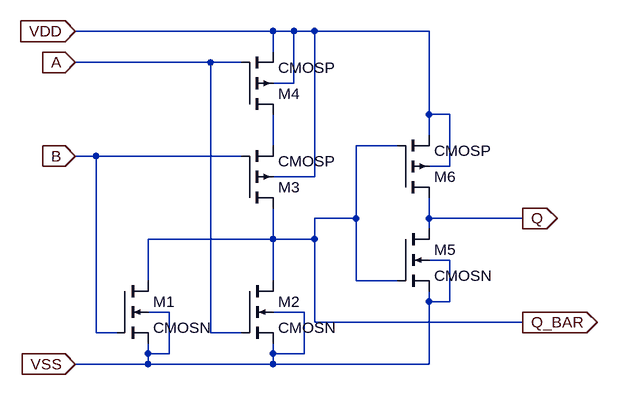
[diagram p0: schematic my_cmos_or.asc]
my_cmos_or.asc, the LTspice schematic file:
Version 4
SHEET 1 880 680
WIRE 112 -384 -192 -384
WIRE 144 -384 112 -384
WIRE 176 -384 144 -384
WIRE 352 -384 176 -384
WIRE 112 -352 112 -384
WIRE 16 -336 -192 -336
WIRE 64 -336 16 -336
WIRE 144 -304 144 -384
WIRE 144 -304 112 -304
WIRE 352 -256 352 -384
WIRE 384 -256 352 -256
WIRE 352 -224 352 -256
WIRE 112 -208 112 -256
WIRE 304 -208 240 -208
WIRE -160 -192 -192 -192
WIRE 64 -192 -160 -192
WIRE 384 -176 384 -256
WIRE 384 -176 352 -176
WIRE 176 -160 176 -384
WIRE 176 -160 112 -160
WIRE 240 -96 240 -208
WIRE 240 -96 176 -96
WIRE 352 -96 352 -128
WIRE 496 -96 352 -96
WIRE 352 -80 352 -96
WIRE 112 -64 112 -112
WIRE 112 -64 -80 -64
WIRE 176 -64 176 -96
WIRE 176 -64 112 -64
WIRE 384 -32 352 -32
WIRE -80 0 -80 -64
WIRE 112 0 112 -64
WIRE 240 0 240 -96
WIRE 304 0 240 0
WIRE 352 32 352 16
WIRE 384 32 384 -32
WIRE 384 32 352 32
WIRE -48 48 -80 48
WIRE 160 48 112 48
WIRE 176 64 176 -64
WIRE 496 64 176 64
WIRE -160 80 -160 -192
WIRE -128 80 -160 80
WIRE 16 80 16 -336
WIRE 64 80 16 80
WIRE -80 112 -80 96
WIRE -48 112 -48 48
WIRE -48 112 -80 112
WIRE 112 112 112 96
WIRE 160 112 160 48
WIRE 160 112 112 112
WIRE -80 128 -80 112
WIRE -80 128 -192 128
WIRE 112 128 112 112
WIRE 112 128 -80 128
WIRE 352 128 352 32
WIRE 352 128 112 128
FLAG 496 -96 Q
IOPIN 496 -96 Out
FLAG -192 -384 VDD
IOPIN -192 -384 In
FLAG -192 -336 A
IOPIN -192 -336 In
FLAG -192 -192 B
IOPIN -192 -192 In
FLAG -192 128 VSS
IOPIN -192 128 In
FLAG 496 64 Q_BAR
IOPIN 496 64 Out
SYMBOL nmos4 -128 0 R0
SYMATTR InstName M1
SYMATTR Value2 l=0.18u w=1.8u m=1
SYMATTR Value CMOSN
SYMBOL nmos4 64 0 R0
SYMATTR InstName M2
SYMATTR Value2 l=0.18u w=1.8u m=1
SYMATTR Value CMOSN
SYMBOL pmos4 64 -112 M180
SYMATTR InstName M3
SYMATTR Value2 l=0.18u w=1.8u m=1
SYMATTR Value CMOSP
SYMBOL pmos4 64 -256 M180
SYMATTR InstName M4
SYMATTR Value2 l=0.18u w=1.8u m=1
SYMATTR Value CMOSP
SYMBOL nmos4 304 -80 R0
SYMATTR InstName M5
SYMATTR Value2 l=0.18u w=1.8u m=1
SYMATTR Value CMOSN
SYMBOL pmos4 304 -128 M180
SYMATTR InstName M6
SYMATTR Value2 l=0.18u w=1.8u m=1
SYMATTR Value CMOSP

The netlist it stands for:
* my_cmos_or.asc
M1 Q_BAR B VSS VSS CMOSN l=0.18u w=1.8u m=1
M2 Q_BAR A VSS VSS CMOSN l=0.18u w=1.8u m=1
M3 Q_BAR B N001 VDD CMOSP l=0.18u w=1.8u m=1
M4 N001 A VDD VDD CMOSP l=0.18u w=1.8u m=1
M5 Q Q_BAR VSS VSS CMOSN l=0.18u w=1.8u m=1
M6 Q Q_BAR VDD VDD CMOSP l=0.18u w=1.8u m=1
.model NMOS NMOS
.model PMOS PMOS
.lib standard.mos
.backanno
.end